# Altium schematic sheet Block_Diagram.SchDoc
size A; SheetNumber: 1; SheetTotal: 8
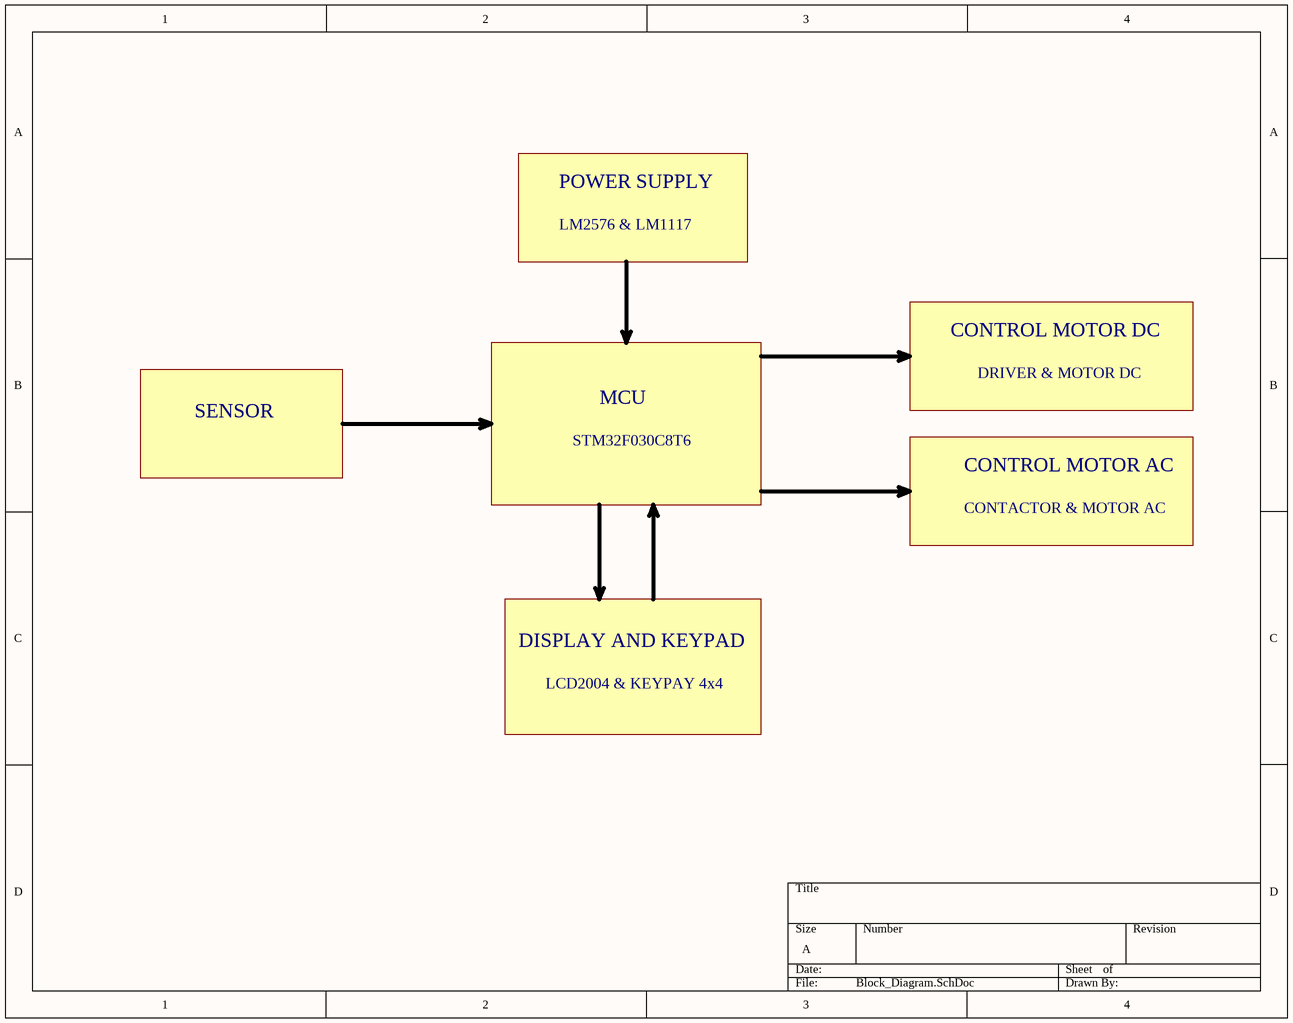
[diagram p0: Block_Diagram.SchDoc]

## Notes on the sheet
- POWER SUPPLY
- LM2576 & LM1117
- CONTROL MOTOR DC
- SENSOR
- MCU
- DRIVER & MOTOR DC
- STM32F030C8T6
- CONTROL MOTOR AC
- CONTACTOR & MOTOR AC
- DISPLAY AND KEYPAD
- LCD2004 & KEYPAY 4x4